# Altium schematic sheet PCB方案验证板  12V5A 60Wascii.SchDoc
size A3; SheetNumber: 1; SheetTotal: 1; PageSetup: Record=PageOptions|CenterHorizontal=True|CenterVertical=True|PrintScale=0.97|XCorrection=1.00|YCorrection=1.00|PrintKind=2|BorderSize=5000000|LeftOffset=0|BottomOffset=0|Orientation=2|PaperLength=1000|PaperWidth=1000|Scale=100|PaperSource=7|PrintQuality=-3|MediaType=1|DitherType=10|PrintScaleMode=1|PaperKind=A4|PaperIndex=9
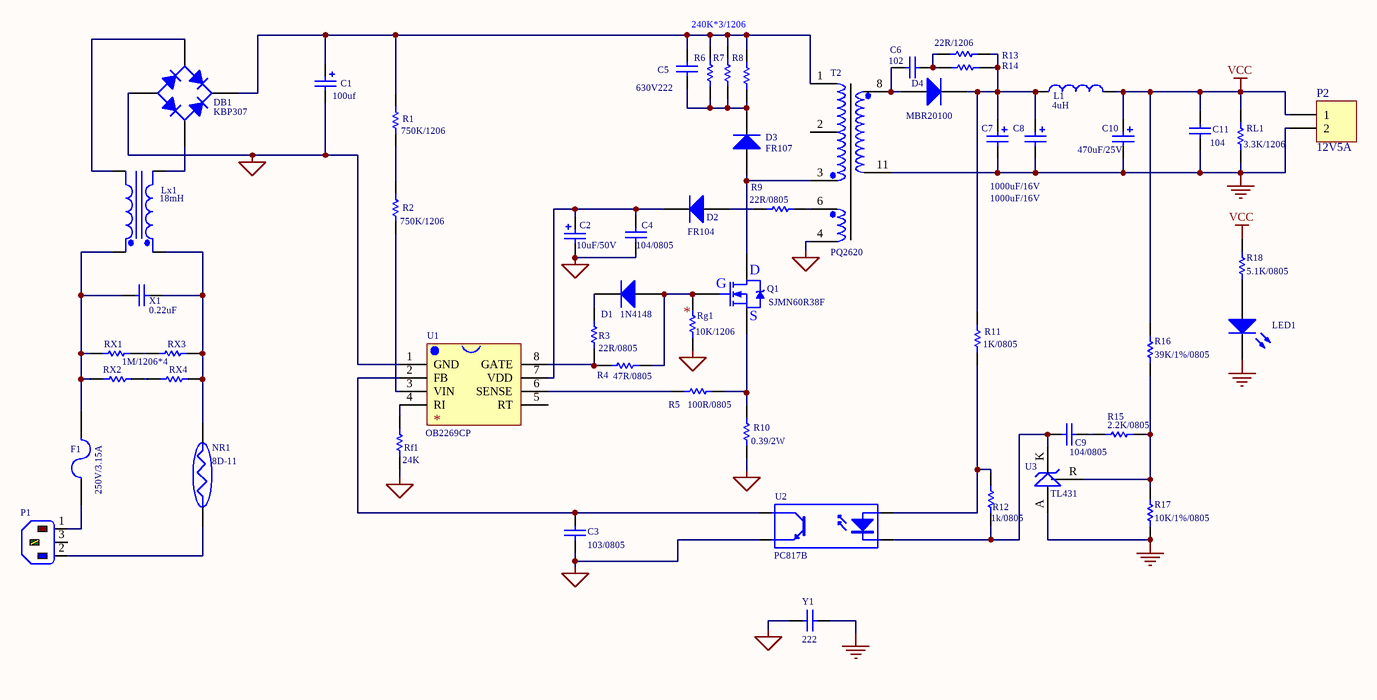
[diagram p0: PCB方案验证板  12V5A 60Wascii.SchDoc]

## Parts
C1  100uf  [Cin /400V/56uF Wo]
C2  value 10uF/50V  [C Φ5*11 L=2.5]  (hidden comment: 47uF/50V)
C3  103/0805  [0805-C]
C4  104/0805  [0805-C]
C5  630V222  [CBB=7.5MM]
C6  value 102  [1206-C]  (hidden comment: 472)
C7  1000uF/16V  [C 1000UF/16V]
C8  1000uF/16V  [C 1000UF/16V]
C9  104/0805  [0805-C]
C10  470uF/25V  [C= 3.5MM 8*15]
C11  104  [1206-C]
D1  1N4148  [D 1N4148]
D2  FR104  [D/SOD123]
D3  FR107  [D/SOD123]
D4  MBR20100  [D TO-220]
DB1  KBP307  [DB D=1.1MM]
F1  250V/3.15A  [F 3.15A L=5MM]
L1  4uH  [L=7.6MM]
LED1  LED1  [C0805]  (value not drawn)
Lx1  18mH  [LF=6.9MM]
NR1  8D-11  [NTC=7.5mm]
P1  Plug AC Male  [KF128-3.81-2P]  (value not drawn)
P2  12V5A  [OUT]
Q1  SJMN60R38F  [MOSFET1]
R1  750K/1206  [1206-R]
R2  750K/1206  [1206-R]
R3  22R/0805  [0805-R]
R4  47R/0805  [0805-R]
R5  100R/0805  [0805-R]
R6  50K/2510/1W  [1206-R]  (value not drawn)
R7  50K/2510/1W  [1206-R]  (value not drawn)
R8  50K/2510/1W  [1206-R]  (value not drawn)
R9  22R/0805  [0805-R]
R10  0.39/2W  [R  2W]
R11  1K/0805  [0805 RC]
R12  1k/0805  [0805-R]
R13  51R/1206  [1206-R]  (value not drawn)
R14  22R/1206  [1206-R]
R15  2.2K/0805  [0805-R]
R16  39K/1%/0805  [0805-R]
R17  value 10K/1%/0805  [0805-R]  (hidden comment: 12.5K/1%/0805)
R18  5.1K/0805  [0805-R]
Rf1  value 24K  [0805-R]  (hidden comment: Res1)
Rg1  value 10K/1206  [0805-R]  (hidden comment: 10K/0805)
RL1  3.3K/1206  [1206-R]
RX1  1M/1206*4  [1206-R]
RX2  1M/1206  [1206-R]  (value not drawn)
RX3  1M/1206  [1206-R]  (value not drawn)
RX4  1M/1206  [1206-R]  (value not drawn)
T2  PQ2620  [T PQ2620]
U1  OB2269CP  [OB2269]
U2  PC817B  [LC-SMD-4]
U3  TL431  [LC-SOT-23(SOT-23-3)]
X1  value 0.22uF  [CX=10mm]  (hidden comment: 224)
Y1  222  [Y1]

## Nets
GND: C7.1 C8.1 C10.1 C11.2 LED1.2(K) P2.GND(2) R17.1 RL1.1 T2.11 U3.A Y1.2
GND1: C1.2 C2.2 C3.1 C4.2 DB1.- R10.1 Rf1.2 Rg1.2 T2.4 U1.1(GND) U2.E Y1.1
VCC: C10.2 C11.1 L1.2 P2.VCC(1) R16.2 R18.2 RL1.2
NetC1_1: C1.1 C5.1 DB1.+ R1.2 R6.1 R7.1 R8.1 T2.1
NetC2_1: C2.1 C4.1 D2.2(K) U1.7(VDD)
NetC3_2: C3.2 U1.2(FB) U2.C
NetC5_2: C5.2 D3.2(K) R6.2 R7.2 R8.2
NetC6_1: C6.1 D4.1(A) T2.8
NetC6_2: C6.2 R13.2 R14.2
NetC7_2: C7.2 C8.2 D4.2(K) L1.1 R11.2 R13.1 R14.1
NetC9_1: C9.1 R12.1 U2.K U3.K
NetC9_2: C9.2 R15.2
NetD1_+: D1.+(A) Q1.G R4.1 Rg1.1
NetD1_-: D1.-(K) R3.1
NetD2_1: D2.1(A) R9.2
NetD3_1: D3.1(A) Q1.D T2.3
NetDB1_L: DB1.L Lx1.2(Sec-)
NetDB1_N: DB1.N Lx1.4(Pri-)
NetF1_1: F1.1 P1.1(L)
NetF1_2: F1.2 Lx1.3(Sec+) RX1.1 RX2.1 X1.1
NetLED1_1: LED1.1(A) R18.1
NetLx1_1: Lx1.1(Pri+) NR1.1 RX3.2 RX4.2 X1.2
NetNR1_2: NR1.2 P1.2(N)
NetQ1_S: Q1.S R5.1 R10.2
NetR1_1: R1.1 R2.2
NetR2_1: R2.1 U1.3(VIN)
NetR3_2: R3.2 R4.2 U1.8(GATE)
NetR5_2: R5.2 U1.6(SENSE)
NetR9_1: R9.1 T2.6
NetR11_1: R11.1 R12.2 U2.A
NetR15_1: R15.1 R16.1 R17.2 U3.R
NetRf1_1: Rf1.1 U1.4(RI)
NetRX1_2: RX1.2 RX3.1
NetRX2_2: RX2.2 RX4.1

Not connected (* = marked no-connect by the designer): P1 3(E); T2 2; U1 5(RT)

## Notes on the sheet
- 240K*3/1206
- (near Rg1) *
- (near Q1) G
- (near Q1) D
- (near Q1) S
- (near U1) *

## Library data of the parts
C1 C2 = Cap Pol2: Polarized Capacitor (Axial); Published: 8-Jun-2000; LatestRevisionDate: 17-Jul-2002; LatestRevisionNote: Re-released for DXP Platform.; PackageReference: POLAR0.8; Publisher: Altium Limited; PackageDescription: Polarized Capacitor; 2 Leads
C3 C6 C9 C11 X1 Y1 = Cap: Capacitor; Published: 8-Jun-2000; LatestRevisionDate: 17-Jul-2002; LatestRevisionNote: Re-released for DXP Platform.; PackageReference: RAD-0.3; Publisher: Altium Limited; PackageDescription: Radial Cap, Thru-Hole; 2 Leads; 0.3 in Pin Spacing
  C3: Value: 103/0805
  C9: Value: 104/0805
  C11: Value: 104
  Y1: Value: 222
C4 = Cap: Capacitor; Value: 104/1206; Published: 8-Jun-2000; LatestRevisionDate: 17-Jul-2002; LatestRevisionNote: Re-released for DXP Platform.; PackageReference: RAD-0.3; Publisher: Altium Limited; PackageDescription: Radial Cap, Thru-Hole; 2 Leads; 0.3 in Pin Spacing
C5 = Cap: Capacitor; Value: 1000V103; Published: 8-Jun-2000; LatestRevisionDate: 17-Jul-2002; LatestRevisionNote: Re-released for DXP Platform.; PackageReference: RAD-0.3; Publisher: Altium Limited; PackageDescription: Radial Cap, Thru-Hole; 2 Leads; 0.3 in Pin Spacing
C7 C8 C10 = Cap Pol2: Polarized Capacitor (Axial); Value: 2200uF/25V; Published: 8-Jun-2000; LatestRevisionDate: 17-Jul-2002; LatestRevisionNote: Re-released for DXP Platform.; PackageReference: POLAR0.8; Publisher: Altium Limited; PackageDescription: Polarized Capacitor; 2 Leads
D1-D4 = Diode BAS116: Silicon Low Leakage Diode; Note: Pin 2 is not connected and not drawn.; Published: 21-Mar-2003; LatestRevisionDate: 29-May-2009; LatestRevisionNote: IPC-7351 Footprint Added.; DatasheetVersion: Oct-1999; PackageVersion: Sep-2001; PackageReference: SOT-23; Publisher: Altium Limited; PackageDescription: 3-Pin SOT-23 Package 0.95 mm Pitch, 2.5 mm Lead Span; ComponentLink1Description: Manufacturer Link; ComponentLink1URL: http://www.infineon.com/; ComponentLink2Description: Datasheet; ComponentLink2URL: http://www.infineon.com/upload/Document/cmc_upload/documents/080/656/bas116series.pdf
DB1 = Bridge1: Full Wave Diode Bridge; Published: 8-Jun-2000; LatestRevisionDate: 29-May-2009; LatestRevisionNote: Sch pins A & K swapped.; DatasheetVersion: E2732B; PackageReference: D-38; Publisher: Altium Limited; PackageDescription: Bridge Rectifier; 4 Terminals; Body 9.4 x 9.4 mm (typ); Pitch 5.08 mm
F1 = Fuse 2: Fuse; Published: 8-Jun-2000; LatestRevisionDate: 17-Jul-2002; LatestRevisionNote: Re-released for DXP Platform.; PackageReference: PIN-W2/E2.8; Publisher: Altium Limited; PackageDescription: Thru-Hole; 2 Leads
L1 = Inductor: Code_IEC: 1005; Published: 8-Jun-2000; LatestRevisionDate: 29-May-2009; LatestRevisionNote: IPC-7351 Footprint Added.; PackageReference: 0402-A; Publisher: Altium Limited; PackageDescription: Chip Inductor; Code_JEITA: 0402
LED1 = LED2: Typical RED, GREEN, YELLOW, AMBER GaAs LED; Published: 8-Jun-2000; LatestRevisionDate: 17-Jul-2002; LatestRevisionNote: Re-released for DXP Platform.; PackageVersion: Feb-2002; PackageReference: 3.2X1.6X1.1; Publisher: Altium Limited; PackageDescription: SM LED; 2 Flat Leads
Lx1 = Trans Ideal: Transformer (Ideal); Published: 8-Jun-2000; LatestRevisionDate: 17-Jul-2002; LatestRevisionNote: Re-released for DXP Platform.; PackageReference: TRF_4; Publisher: Altium Limited; PackageDescription: Transformer; 4 Leads
NR1 = NTC
P1 = Plug AC Male: IEC Mains Power Inlet, EN60 320-1 C14 Class I Cold Condition, PC Flange Rear Mount, Chassis Plug; PackageDocument: ver.80, 15-Sep-2003; MaximumRating: 10A, 250V a.c. (UL & CSA 15A, 250V a.c.); MountingFixtures: Not drawn on schematic symbol.; PCB_Layout: Complies with manufacturer's recommendation.; DrillSize: Corresponds to nominal value.; Note: IEC Color Scheme employed for L, N and E.; Published: 15-Jul-2004; LatestRevisionDate: 15-Jul-2004; LatestRevisionNote: Component Replaced.; DatasheetDocument: ver.80, 15-Sep-2003; PackageReference: PX0580/PC; Publisher: Altium Limited; Terminations: P.C. Spills; ComponentLink1Description: Manufacturer Link; ComponentLink1URL: http://www.bulgin.co.uk/
P2 = Header 2: Header, 2-Pin; LatestRevisionDate: 17-Jul-2002; LatestRevisionNote: Re-released for DXP Platform.; Publisher: Altium Limited
Q1 = NMOS-2: N-Channel Power MOSFET; Note: Pin 2 is electrically connected to pin 4.; Published: 8-Jun-2000; LatestRevisionDate: 17-Jul-2002; LatestRevisionNote: Re-released for DXP Platform.; DatasheetVersion: PD-9.814; PackageVersion: Feb-1997; PackageReference: TO-220AB; Publisher: Altium Limited; PackageDescription: TO, Thru-Hole, Vertical, Heatsink Mounted; 3 In-Line Leads; Pitch 2.54 mm; ComponentLink1Description: Manufacturer Link; ComponentLink1URL: http://www.irf.com/
R1 R2 R9 R10 R12 R16-R18 Rf1 Rg1 RX1-RX4 = Res1: Resistor; Published: 8-Jun-2000; LatestRevisionDate: 17-Jul-2002; LatestRevisionNote: Re-released for DXP Platform.; PackageReference: AXIAL-0.3; Publisher: Altium Limited; PackageDescription: Axial Device, Thru-Hole; 2 Leads; 0.3 in Pin Spacing
  R1 R2: Value: 750K/1206
  R12: Value: 1k/0805
  R16: Value: 39K/1%/0805
  RX1-RX4: Value: 1M/1206
R3 = Res1: Resistor; Value: 30R/1206; Published: 8-Jun-2000; LatestRevisionDate: 17-Jul-2002; LatestRevisionNote: Re-released for DXP Platform.; PackageReference: AXIAL-0.3; Publisher: Altium Limited; PackageDescription: Axial Device, Thru-Hole; 2 Leads; 0.3 in Pin Spacing
R4 = Res1: Resistor; Value: /47R/1206; Published: 8-Jun-2000; LatestRevisionDate: 17-Jul-2002; LatestRevisionNote: Re-released for DXP Platform.; PackageReference: AXIAL-0.3; Publisher: Altium Limited; PackageDescription: Axial Device, Thru-Hole; 2 Leads; 0.3 in Pin Spacing
R5 = Res1: Resistor; Value: 390/1206; Published: 8-Jun-2000; LatestRevisionDate: 17-Jul-2002; LatestRevisionNote: Re-released for DXP Platform.; PackageReference: AXIAL-0.3; Publisher: Altium Limited; PackageDescription: Axial Device, Thru-Hole; 2 Leads; 0.3 in Pin Spacing
R6-R8 = Res1: Resistor; Value: 100K/2W; Published: 8-Jun-2000; LatestRevisionDate: 17-Jul-2002; LatestRevisionNote: Re-released for DXP Platform.; PackageReference: AXIAL-0.3; Publisher: Altium Limited; PackageDescription: Axial Device, Thru-Hole; 2 Leads; 0.3 in Pin Spacing
R11 = Res1: Resistor; Value: 470/0805; Published: 8-Jun-2000; LatestRevisionDate: 17-Jul-2002; LatestRevisionNote: Re-released for DXP Platform.; PackageReference: AXIAL-0.3; Publisher: Altium Limited; PackageDescription: Axial Device, Thru-Hole; 2 Leads; 0.3 in Pin Spacing
R13 = Res1: Resistor; Value: 68R/1206; Published: 8-Jun-2000; LatestRevisionDate: 17-Jul-2002; LatestRevisionNote: Re-released for DXP Platform.; PackageReference: AXIAL-0.3; Publisher: Altium Limited; PackageDescription: Axial Device, Thru-Hole; 2 Leads; 0.3 in Pin Spacing
R14 = Res1: Resistor; Value: 47R/1206; Published: 8-Jun-2000; LatestRevisionDate: 17-Jul-2002; LatestRevisionNote: Re-released for DXP Platform.; PackageReference: AXIAL-0.3; Publisher: Altium Limited; PackageDescription: Axial Device, Thru-Hole; 2 Leads; 0.3 in Pin Spacing
R15 = Res1: Resistor; Value: 200/0805; Published: 8-Jun-2000; LatestRevisionDate: 17-Jul-2002; LatestRevisionNote: Re-released for DXP Platform.; PackageReference: AXIAL-0.3; Publisher: Altium Limited; PackageDescription: Axial Device, Thru-Hole; 2 Leads; 0.3 in Pin Spacing
RL1 = Res1: Resistor; Value: 750K/1206; Published: 8-Jun-2000; LatestRevisionDate: 17-Jul-2002; LatestRevisionNote: Re-released for DXP Platform.; PackageReference: AXIAL-0.3; Publisher: Altium Limited; PackageDescription: Axial Device, Thru-Hole; 2 Leads; 0.3 in Pin Spacing
T2 = T
U2 = Optoisolator1: 4-Pin Phototransistor Optocoupler; Published: 24-Mar-1999; LatestRevisionDate: 04-Mar-2005; LatestRevisionNote: Sch pins 3 & 4 Swapped.; DatasheetVersion: Nov-2003; PackageReference: DIP-4; Publisher: Altium Limited